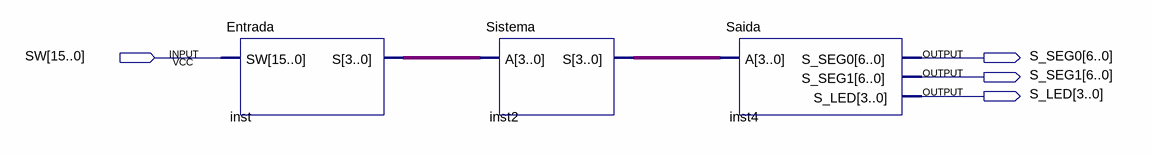
[diagram p0: schematic sheet]
// Quartus schematic GrayCode.bdf as structural Verilog: 3 symbols, 4 pins
module GrayCode (
  input  [15:0] SW,
  output [6:0] S_SEG0,
  output [6:0] S_SEG1,
  output [3:0] S_LED
);

  wire [3:0] inst2_s, inst_s;

  Entrada inst (.SW(SW), .S(inst_s));
  Sistema inst2 (.A(inst_s), .S(inst2_s));
  Saida inst4 (.A(inst2_s), .S_SEG0(S_SEG0), .S_SEG1(S_SEG1), .S_LED(S_LED));
endmodule
